# EAGLE design main (EAGLE 9.6.2)
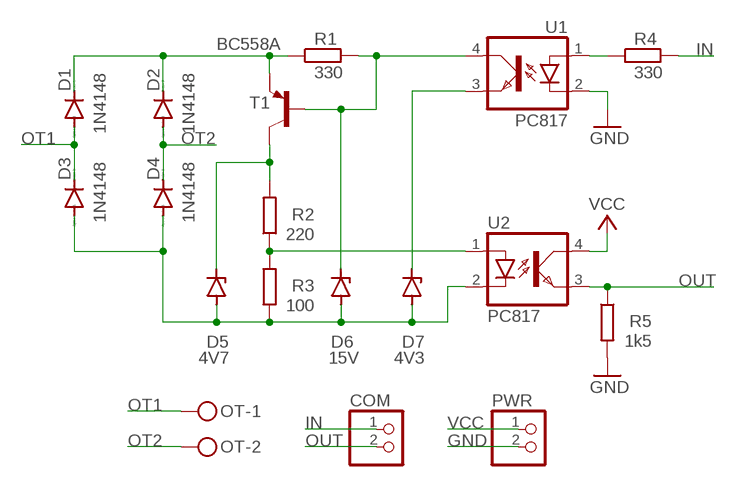
[diagram p0: schematic, sheet 1]

## Parts
COM  PINHD-1X2  [1X02]
D1  1N4148  1N4148DO35-7  [DO35-7]
D2  1N4148  1N4148DO35-7  [DO35-7]
D3  1N4148  1N4148DO35-7  [DO35-7]
D4  1N4148  1N4148DO35-7  [DO35-7]
D5  4V7  ZENER-DIODEZD-7.5  [ZDIO-7.5]
D6  15V  ZENER-DIODEZD-7.5  [ZDIO-7.5]
D7  4V3  ZENER-DIODEZD-7.5  [ZDIO-7.5]
OT  MKDSN1,5/2-5,08  [MKDSN1,5/2-5,08]
PWR  PINHD-1X2  [1X02]
R1  330  R-EU_0207/10  [0207/10]
R2  220  R-EU_0207/10  [0207/10]
R3  100  R-EU_0207/10  [0207/10]
R4  330  R-EU_0207/10  [0207/10]
R5  1k5  R-EU_0207/10  [0207/10]
T1  BC558A  BC558A-PNP-TO92-EBC  [TO92-EBC]
U1  PC817  [DIL04]
U2  PC817  [DIL04]

## Nets
GND: PWR.2 R5.2 U1.2(C)
IN: COM.1 R4.2
N$1: D1.C D2.C R1.1 T1.E
N$2: R2.1 R3.2 U2.1(A)
N$5: D5.C R2.2 T1.C
N$6: D6.C R1.2 T1.B U1.4(COL)
N$7: D7.C U1.3(EMIT)
N$8: D3.A D4.A D5.A D6.A D7.A R3.1 U2.2(C)
N$13: R4.1 U1.1(A)
OT1: D1.A D3.C OT.1
OT2: D2.A D4.C OT.2
OUT: COM.2 R5.1 U2.3(EMIT)
VCC: PWR.1 U2.4(COL)

## Library data of the parts
COM PWR = pinhead:PINHD-1X2: PIN HEADER
D1-D4 = diode:1N4148: DIODE high speed (Philips)
D5-D7 = diode:ZENER-DIODE: Z-Diode
OT = con-phoenix-508:MKDSN1,5/2-5,08: MKDSN 1,5/ 2-5,08 Printklemme Nennstrom: 13,5 A Nennspannung: 250 V Rastermaß: 5,08 mm Polzahl: 2 Anschlussart: Schraubanschluss Montage: Löten Anschlussrichtung Leiter/Platine: 0 ° Artikelnummer: 1729128 Source: http://eshop.phoenixcontact.com .. 1729128.pdf
R1-R5 = rcl:R-EU_: RESISTOR, European symbol; SPICEPREFIX: R
T1 = transistor:*-PNP-: PNP Transistror
U1 U2 = optocoupler:PC817: SHARP OPTO COUPLER; MPN: PC817X4J000F; OC_FARNELL: 9707727; OC_NEWARK: 97K7059

## Board
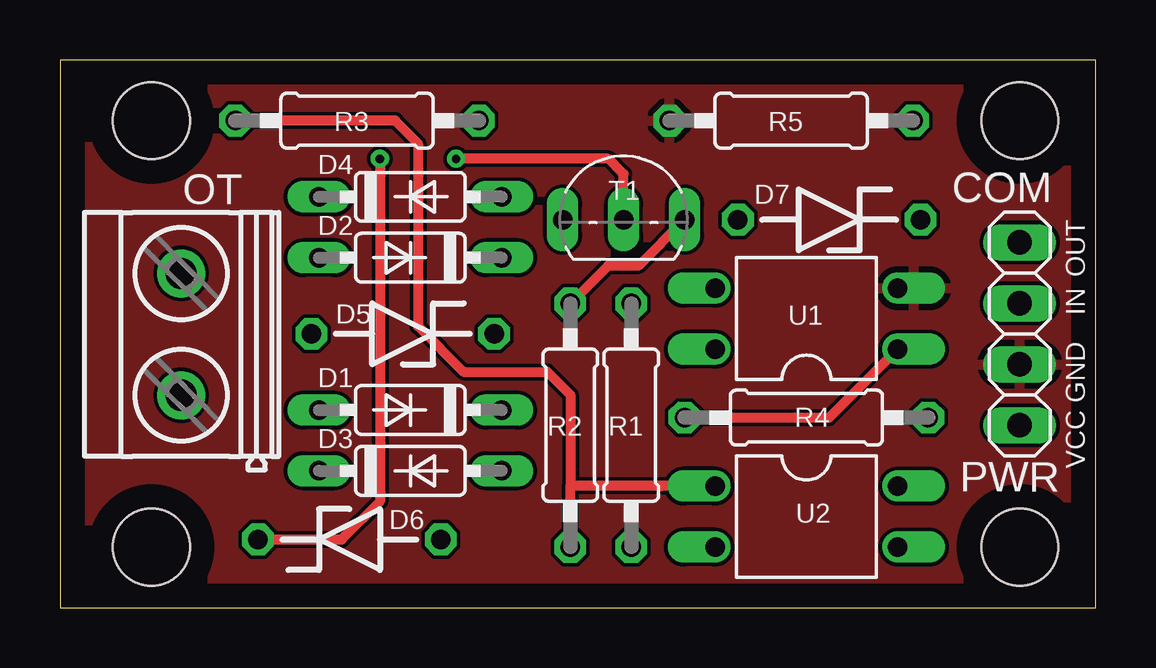
[diagram p1: board, top side]
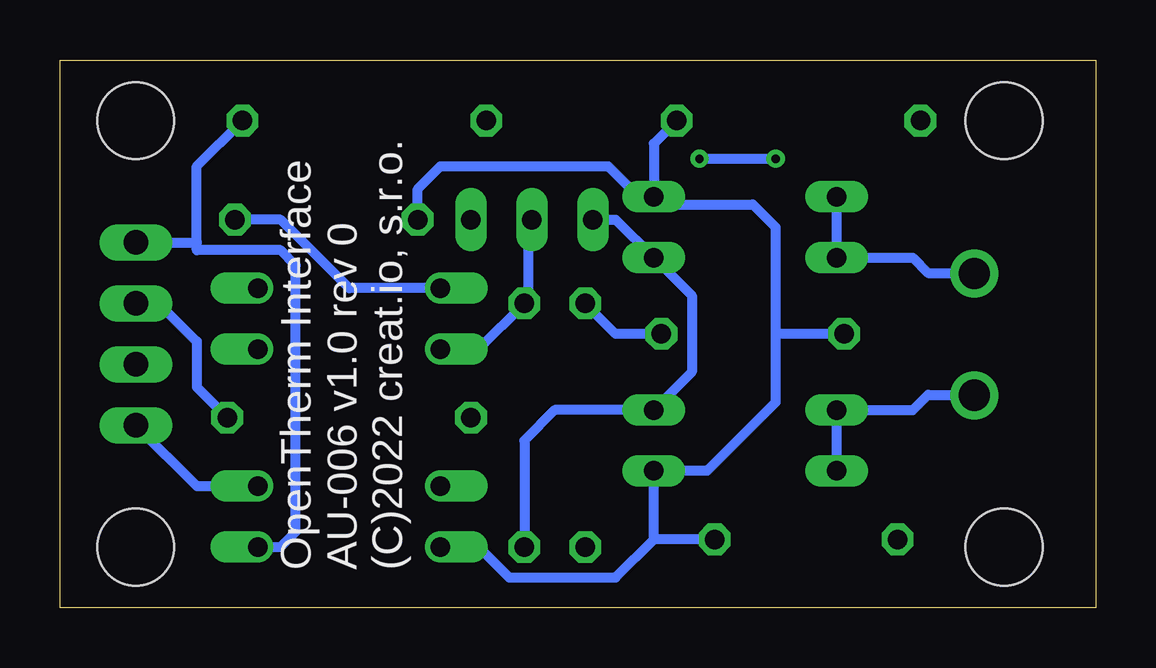
[diagram p2: board, bottom side, seen from below]

Size 43.17 x 22.85 mm. Coordinates in mm from the lower left corner, seen from the top.
Outline: 0,0 43.17,0 43.17,22.85 0,22.85 0,0
Copper layers (1*16): Top 0.035mm / dielectric 1.5mm / Bottom 0.035mm
Design rules "default": minimum track width 6mil, minimum drill 0.35mm, track to track 6mil, track to pad 6mil, pad to pad 6mil, via to via 6mil, smd to smd 6mil, copper to edge 40mil, drill to drill 6mil, minimum pad ring 10mil, minimum via ring 8mil, stop-mask expansion 4mil, vias tented up to drill 0mil, thermal gap 10mil
Holes 3.2 mm at 3.81,20.32 3.81,2.54 40.01,2.54 40.01,20.32

### Footprints (pad centres in the part's own frame; a part is rotated, then mirrored left to right if it is on the bottom)
1X02 = drill 1.016 long: 1 -1.27,0; 2 1.27,0
DO35-7 = drill 0.813 long: A 3.81,0; C -3.81,0
ZDIO-7.5 = drill 0.813 octagon: A 3.81,0; C -3.81,0
MKDSN1,5/2-5,08 = drill 1.3 pad 2: 1 -2.561,0.025; 2 2.519,0.025
0207/10 = drill 0.813 octagon: 1 -5.08,0; 2 5.08,0
TO92-EBC = drill 0.813 long: B 0,-1.27; C 2.54,-1.27; E -2.54,-1.27
DIL04 = drill 0.813 offset: 1 -1.27,-3.81; 2 1.27,-3.81; 3 1.27,3.81; 4 -1.27,3.81

### Placement (x,y rotation side)
COM  40.01,13.97 90 top
D1  14.61,8.26 180 top
D2  14.61,14.61 180 top
D3  14.61,5.71 0 top
D4  14.61,17.14 0 top
D5  14.29,11.43 180 top
D6  12.06,2.86 0 top
D7  32.07,16.19 180 top
OT  5.08,11.43 90 top
PWR  40.01,8.89 90 top
R1  23.81,7.62 90 top
R2  21.27,7.62 90 top
R3  12.38,20.32 180 top
R4  31.11,7.94 0 top
R5  30.48,20.32 180 top
T1  23.5,17.46 0 top
U1  31.11,12.06 90 top
U2  31.11,3.81 270 top

### Tracks (layer width: path | path; a pad name or v marks a point on that pad's centre or on a via)
GND
  pour Top: 0,22.86 49.53,22.86 49.53,0 0,0
IN
  Bottom 0.406: COM.1 39.05,12.7 37.47,11.11 37.47,9.21 R4.2
N$1
  Bottom 0.406: T1.E 20,16.19 D2.C 16.83,13.02 16.83,9.84 D1.C 22.54,8.26 23.81,6.99 R1.1
N$2
  Top 0.406: R2.1 21.27,5.08 | R3.2 13.97,20.32 14.92,19.37 14.92,11.75 16.83,9.84 20.32,9.84 21.27,8.89 21.27,5.08 | U2.1 25.08,5.08 21.27,5.08
N$5
  Top 0.406: R2.2 22.86,14.29 24.13,14.29 T1.C
  Bottom 0.406: D5.C 20,11.43 R2.2
N$6  (via drill 0.35)
  Top 0.406: D6.C 11.75,2.86 13.34,4.45 v13.34,18.73 | T1.B 23.5,18.1 22.86,18.73 v16.51,18.73
  Bottom 0.406: U1.4 25.72,10.79 R1.2 23.65,12.86 | 23.65,12.86 23.5,13.02 | T1.B 23.65,16.03 23.65,12.86 | v16.51,18.73 v13.34,18.73
N$7
  Bottom 0.406: U1.3 31.11,13.34 33.97,16.19 D7.C
N$8
  Bottom 0.406: U2.2 25.72,2.54 24.45,1.27 20,1.27 18.41,2.86 | 18.41,2.86 D3.A 16.19,5.71 13.34,8.57 13.34,11.43 | D6.A 18.41,2.86 | D7.A 28.26,17.46 27.3,18.41 20.32,18.41 19.05,17.14 D4.A | R3.1 18.41,19.37 D4.A | D4.A 18.1,16.83 14.29,16.83 13.34,15.88 13.34,11.43 | D5.A 13.34,11.43
N$13
  Top 0.406: R4.1 32.07,7.94 U1.1
OT1
  Bottom 0.406: D3.C D1.A 7.62,8.26 6.99,8.89 5.08,8.89 OT.1
OT2
  Bottom 0.406: OT.2 5.08,13.97 6.99,13.97 7.62,14.61 D2.A D4.C
OUT
  Bottom 0.406: U2.3 33.97,2.54 33.34,3.17 33.34,14.29 33.97,14.92 37.47,14.92 37.47,15.24 | R5.1 37.47,18.41 37.47,15.24 | COM.2 37.47,15.24
VCC
  Bottom 0.406: PWR.1 37.47,5.08 U2.4

### Text on the board
tNames: OUT | IN | GND | VCC
bNames: OpenTherm Interface / AU-006 v1.0 rev 0 / (C)2022 creat.io, s.r.o.